# Altium schematic sheet current-limiter.SchDoc
size A4
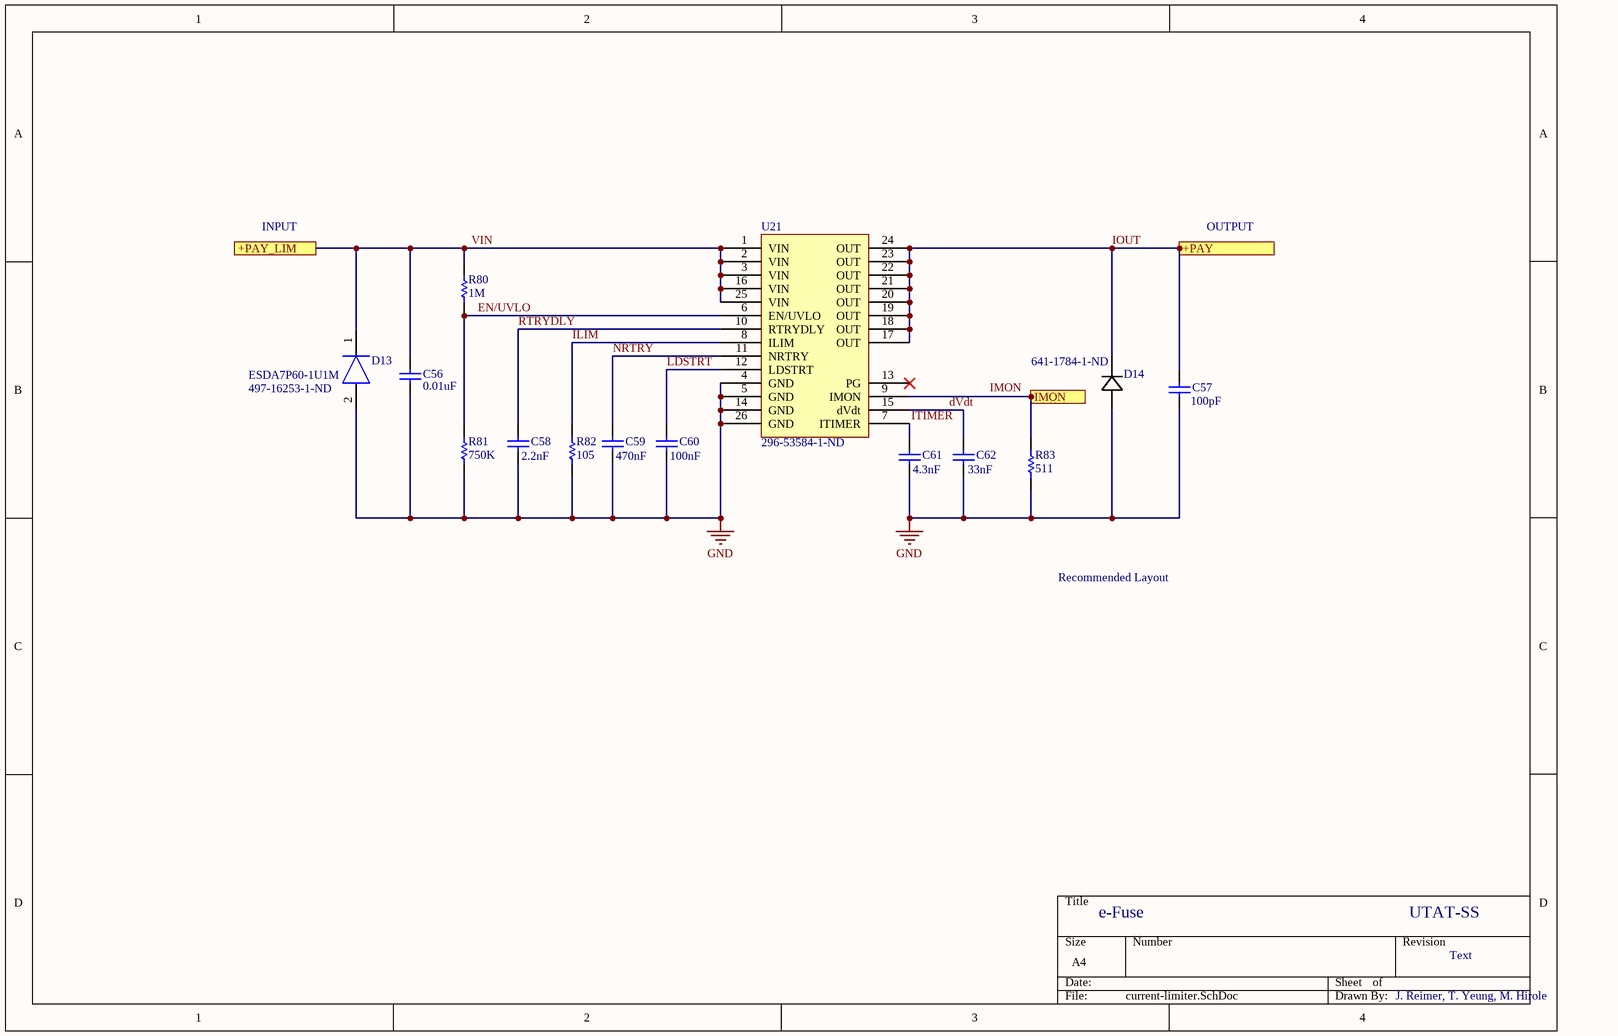
[diagram p0: current-limiter.SchDoc]

## Parts
C56  value 0.01uF  [CAP0603R]  (hidden comment: 0603)
C57  value 100pF  [CAP0603R]  (hidden comment: 0603)
C58  value 2.2nF  [CAP0402R]  (hidden comment: 0402)
C59  value 470nF  [CAP0402R]  (hidden comment: 0402)
C60  value 100nF  [CAP0402R]  (hidden comment: 0402)
C61  value 4.3nF  [CAP0402R]  (hidden comment: 0402)
C62  value 33nF  [CAP0402R]  (hidden comment: 0402)
D13  ESDA7P60-1U1M  Supplier Part Number 1: 497-16253-1-ND  [ESDA7P601U1M]
D14  Supplier Part Number 1: 641-1784-1-ND  [ESC]  (hidden comment: Part Number: 1SS389)
R80  value 1M  [RES0402R]  (hidden comment: 0402)
R81  value 750K  [RES0402R]  (hidden comment: 0402)
R82  value 105  [RES0402R]  (hidden comment: 0402)
R83  value 511  [RES0402R]  (hidden comment: 0402)
U21  Supplier Part Number 1: 296-53584-1-ND  [RGE0024M]  (hidden comment: eFuse)

## Ports
+PAY, +PAY_LIM, IMON (out)

## Nets
GND: C56.1 C57.1 C58.1 C59.1 C60.1 C61.1 C62.1 D13.2(A) D14.2(ANODE) R81.1 R82.1 R83.1 U21.4(GND) U21.5(GND) U21.14(GND) U21.26(GND)
dVdt: C62.2 U21.15(dVdt)
EN/UVLO: R80.1 R81.2 U21.6(EN/UVLO)
ILIM: R82.2 U21.8(ILIM)
IMON: R83.2 U21.9(IMON) ; port IMON
IOUT: C57.2 D14.1(CATHODE) U21.17(OUT) U21.18(OUT) U21.19(OUT) U21.20(OUT) U21.21(OUT) U21.22(OUT) U21.23(OUT) U21.24(OUT) ; port +PAY
LDSTRT: C60.2 U21.12(LDSTRT)
NRTRY: C59.2 U21.11(NRTRY)
RTRYDLY: C58.2 U21.10(RTRYDLY)
VIN: C56.2 D13.1(K) R80.2 U21.1(VIN) U21.2(VIN) U21.3(VIN) U21.16(VIN) U21.25(VIN) ; port +PAY_LIM
NetC61_2: C61.2 U21.7(ITIMER)

Not connected (* = marked no-connect by the designer): U21 13(PG)*

## Notes on the sheet
- INPUT
- OUTPUT
- Recommended Layout
- e-Fuse
- UTAT-SS
- Text
- J. Reimer, T. Yeung, M. Hirole
- Labels drawn without touching a wire or pin: IMON, ITIMER

## Library data of the parts
C56 C57 = CAP0603: 0603 capacitor; Supplier 1: Digi-Key
  C56: Supplier Part Number 1: 490-9729-1-ND
  C57: Supplier Part Number 1: 490-4767-6-ND
C58-C62 = CAP0402: 0402 capacitor; Supplier 1: Digi-Key
  C58: Supplier Part Number 1: 490-4914-6-ND
  C59: Supplier Part Number 1: 490-3264-6-ND
  C60: Supplier Part Number 1: 490-6328-6-ND
  C61: Supplier Part Number 1: 490-8245-6-ND
  C62: Supplier Part Number 1: 490-11984-6-ND
D13 = ESDA7P60-1U1M: Diode; Manufacturer_Name: STMicroelectronics; Number of Unidirectional Channels: 1; Reverse Standoff Voltage: 5V; Min Breakdown Voltage: 6.4V; Clamping Voltage: 11.6V; Peak Pulse Power: 700W; Power Line Protection: No; Polarity: Unidirectional; Max Breakdown Voltage: 7.2V; Peak Pulse Current: 60A; Datasheet Link: https://www.st.com/resource/en/datasheet/esda7p60-1u1m.pdf; Height: 0.6mm; Manufacturer_Part_Number: ESDA7P60-1U1M; Mouser Part Number: 511-ESDA7P60-1U1M; Mouser Price/Stock: https://www.mouser.com/Search/Refine.aspx?Keyword=511-ESDA7P60-1U1M; RS Part Number: 1106381P; RS Price/Stock: http://uk.rs-online.com/web/p/products/1106381P; Supplier 1: Digi-Key; Manufacturer: STMicroelectronics; Manufacturer Part Number: ESDA7P60-1U1M; Stock 1: 16331; Pricing 1: 1=0.45, 10=0.363, 100=0.2472, 500=0.1854, 1000=0.13905, 2500=0.12746 (USD); Mount: Surface Mount; Case/Package: 1610; Number of Pins: 2; Min Operating Temperature: -55°C; Max Operating Temperature: 150°C; Packaging: Cut Tape; Composition: Zener; REACH SVHC: No SVHC; ComponentLink1URL: http://www.st.com/content/ccc/resource/technical/document/datasheet/44/e9/26/44/42/ee/4f/e5/DM00139972.pdf/files/DM00139972.pdf/jcr:content/translations/en.DM00139972.pdf?src-supplier=Digi-Key; ComponentLink1Description: http://www.st.com/content/ccc/resource/technical/document/datasheet/44/e9/26/44/42/ee/4f/e5/DM00139972.pdf/files/DM00139972.pdf/jcr:content/translations/en.DM00139972.pdf?src-supplier=Digi-Key; ComponentLink2URL: http://www.farnell.com/datasheets/2041290.pdf?src-supplier=Element14; ComponentLink2Description: http://www.farnell.com/datasheets/2041290.pdf?src-supplier=Element14; ComponentLink3URL: http://www.farnell.com/datasheets/2041290.pdf?src-supplier=Farnell; ComponentLink3Description: http://www.farnell.com/datasheets/2041290.pdf?src-supplier=Farnell
D14 = 1SS389: No Description Available; Manufacturer: Comchip; Manufacturer Part Number: 1SS389-G; Built_By: EMA_Kyle; Vendor: Toshiba; Type: DEV; Description: DIODE SCHOTTKY 10V 100MA SOD523; Average Rectified Current: 100mA; Max Reverse Voltage (DC): 10V; Copyright: Copyright (C) 2016 Accelerated Designs. All rights reserved; Manufacturer_Part_Number: 1SS389; RefDes: RefDes; Value: Value; Supplier 1: Digi-Key; Stock 1: 2304; Pricing 1: 1=0.22, 10=0.184, 25=0.154, 100=0.0975, 250=0.07524, 500=0.06412, 1000=0.04361 (USD); Mount: Surface Mount; Packaging: Tape and Reel; ComponentLink1URL: http://www.comchiptech.com/cms/UserFiles/1SS389-G%20RevA305239.pdf?src-supplier=Digi-Key; ComponentLink1Description: http://www.comchiptech.com/cms/UserFiles/1SS389-G%20RevA305239.pdf?src-supplier=Digi-Key; ComponentLink2URL: http://www.comchiptech.com/admin/files/product/1SS389-G RevA305239.pdf?src-supplier=Digi-Key; ComponentLink2Description: http://www.comchiptech.com/admin/files/product/1SS389-G RevA305239.pdf?src-supplier=Digi-Key
R80-R83 = RES0402: 0402 resistor
  R80: Supplier 1: Digi-Key; Supplier Part Number 1: MCS0402-1.00M-CFDKR-ND
  R81: Supplier 1: Digi-Key; Supplier Part Number 1: YAG3228DKR-ND
U21 = TPS25982: 2.7 - 24 V input supply, 15 A max load current; Manufacturer: Texas Instruments; Manufacturer Part Number: TPS259822LNRGER; Supplier 1: Digi-Key; Stock 1: 3000; Pricing 1: 1=3.96, 10=3.559, 100=2.9163, 500=2.48262, 1000=2.09378 (USD); ComponentLink1URL: https://octopart.com/click/track?ak=2673a2b2&ct=datasheets&sig=0dd3cb2&at=physicalpart&sid=370&ppid=103121101&hlid=28341978&src-supplier=TI+store; ComponentLink1Description: https://octopart.com/click/track?ak=2673a2b2&ct=datasheets&sig=0dd3cb2&at=physicalpart&sid=370&ppid=103121101&hlid=28341978&src-supplier=TI+store; ComponentLink2URL: http://sigma.octopart.com/102096900/technical_drawing/Texas-Instruments-TPS259822LNRGER.pdf?src-supplier=TI+store; ComponentLink2Description: http://sigma.octopart.com/102096900/technical_drawing/Texas-Instruments-TPS259822LNRGER.pdf?src-supplier=TI+store